# Altium project FlatLamp.PrjPcb
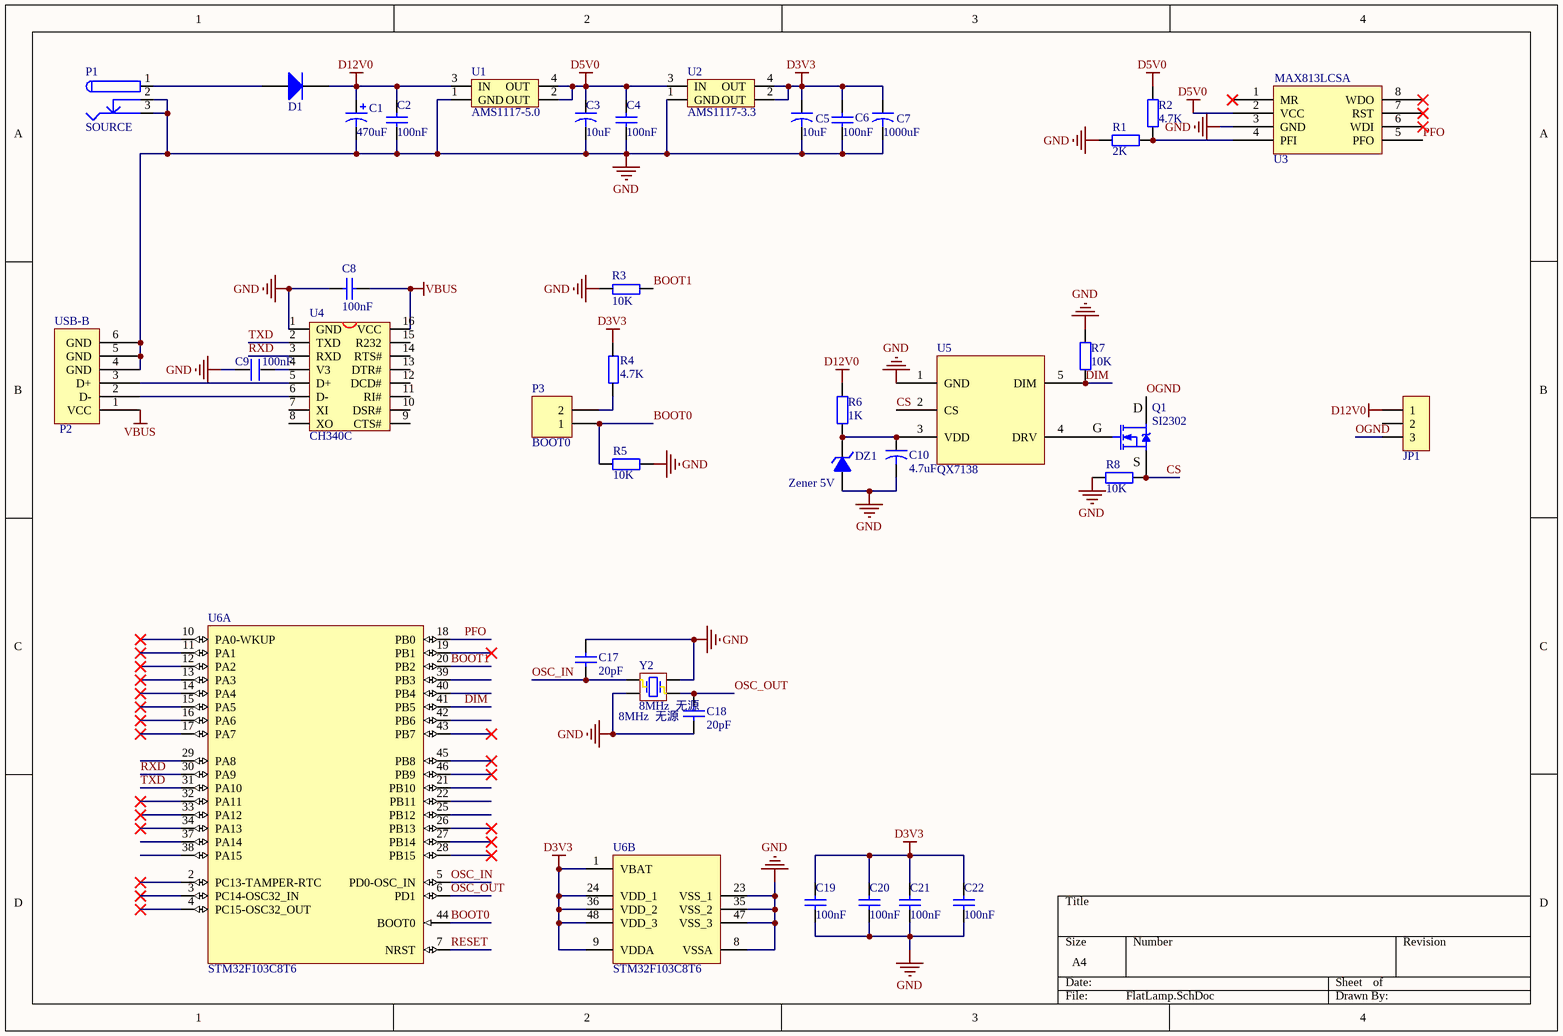
[diagram p0: FlatLamp.SchDoc]
1 sheet, 38 parts. Net scope: global (net labels, ports and power ports of the same name join across sheets).
Board file: FlatLamp.PcbDoc

## Sheet FlatLamp.SchDoc: YNAO Focuser
size A4; DrawnBy: ShouSheng He; Revision: v1.0

### Parts
C1  470uF  [16V/470U(CD10X10D5)]
C2  100nF  [0603C]
C3  10uF  [3216]
C4  100nF  [0603C]
C5  10uF  [3216]
C6  100nF  [0603C]
C7  1000uF  [16V/470U(CD10X10D5)]
C8  100nF  [0603C]
C9  100nF  [0603C]
C10  4.7uF  [3216]
C17  20pF  [0603C]
C18  20pF  [0603C]
C19  100nF  [0603C]
C20  100nF  [0603C]
C21  100nF  [0603C]
C22  100nF  [0603C]
D1  M7  [DO-214AC]  (value not drawn)
DZ1  Zener 5V  [SOD-323]
JP1  HDR-1X3  [HDR2.54-LI-3P]  (value not drawn)
P1  SOURCE  [DC_5.5MM]
P2  USB-B  [USB-B]
P3  BOOT0  [HDR1X2]
Q1  SI2302  [SOT23-3L]
R1  2K  [0603R]
R2  4.7K  [0603R]
R3  10K  [0603R]
R4  4.7K  [0603R]
R5  10K  [0603R]
R6  1K  [0603R]
R7  10K  [0603R]
R8  10K  [1206]
U1  AMS1117-5.0  [SOT223]
U2  AMS1117-3.3  [SOT223]
U3  MAX813LCSA  [SOP-8]
U4  CH340C  [SO-16]
U5  QX7138  [SOT23-5M]
U6  STM32F103C8T6  [LQFP48_N]  (parts A,B of 2)
Y2  8MHz  无源  [X3225]

### Nets
D3V3: C5.1 C6.2 C7.1 C19.2 C20.2 C21.2 C22.2 R4.2 U2.2(OUT) U2.4(OUT) U6.1(VBAT) U6.9(VDDA) U6.24(VDD_1) U6.36(VDD_2) U6.48(VDD_3)
D5V0: C3.1 C4.2 R2.2 U1.2(OUT) U1.4(OUT) U2.3(IN) U3.2(VCC)
D12V0: C1.1 C2.2 D1.2(K) JP1.1 R6.1 U1.3(IN)
GND: C1.2 C2.1 C3.2 C4.1 C5.2 C6.1 C7.2 C8.1 C9.1 C10.2 C17.2 C18.2 C19.1 C20.1 C21.1 C22.1 DZ1.1(A) P1.2 P1.3 P2.4(GND) P2.5(GND) P2.6(GND) R1.2 R3.1 R5.2 R7.1 R8.2 U1.1(GND) U2.1(GND) U3.3(GND) U4.1(GND) U5.1(GND) U6.8(VSSA) U6.23(VSS_1) U6.35(VSS_2) U6.47(VSS_3) Y2.2(NA) Y2.4(NA)
VBUS: C8.2 P2.1(VCC) U4.16(VCC)
BOOT0: P3.1 R5.1 U6.44(BOOT0)
BOOT1: R3.2 U6.20(PB2)
CS: Q1.2(S) R8.1 U5.2(CS)
DIM: R7.2 U5.5(DIM) U6.41(PB5)
OGND: JP1.3 Q1.3(D)
OSC_IN: C17.1 U6.5(PD0-OSC_IN) Y2.1(OSC1)
OSC_OUT: C18.1 U6.6(PD1) Y2.3(OSC2)
PFO: U3.5(PFO) U6.18(PB0)
RESET: U6.7(NRST)
RXD: U4.3(RXD) U6.30(PA9)
TXD: U4.2(TXD) U6.31(PA10)
NetC9_2: C9.2 U4.4(V3)
NetC10_1: C10.1 DZ1.2(K) R6.2 U5.3(VDD)
NetD1_1: D1.1(A) P1.1
NetP2_2: P2.2(D-) U4.6(D-)
NetP2_3: P2.3(D+) U4.5(D+)
NetP3_2: P3.2 R4.1
NetQ1_1: Q1.1(G) U5.4(DRV)
NetR1_1: R1.1 R2.1 U3.4(PFI)

Not connected (* = marked no-connect by the designer): JP1 2; U3 1(MR)* 6(WDI)* 7(RST)* 8(WDO)*; U4 7(XI) 8(XO) 9(CTS#) 10(DSR#) 11(RI#) 12(DCD#) 13(DTR#) 14(RTS#) 15(R232); U6 2(PC13-TAMPER-RTC)* 3(PC14-OSC32_IN)* 4(PC15-OSC32_OUT)* 10(PA0-WKUP)* 11(PA1)* 12(PA2)* 13(PA3)* 14(PA4)* 15(PA5)* 16(PA6)* 17(PA7)* 19(PB1)* 21(PB10) 22(PB11) 25(PB12) 26(PB13)* 27(PB14)* 28(PB15)* 29(PA8) 32(PA11)* 33(PA12)* 34(PA13)* 37(PA14) 38(PA15) 39(PB3) 40(PB4) 42(PB6) 43(PB7)* 45(PB8)* 46(PB9)*

### Library data of the parts
C1 = C470UF016S: 470UF      16V      CD10X10D5
C2 C4 C6 C8 C17-C22 = Cap: Capacitor; Published: 8-Jun-2000; LatestRevisionDate: 17-Jul-2002; LatestRevisionNote: Re-released for DXP Platform.; PackageReference: RAD-0.3; Publisher: Altium Limited
  C2 C4 C6 C8 C19-C22: Value: 100nF
  C17 C18: Value: 20pF
C3 C5 C7 C10 = CAP2
  C3 C5: vaule: 10uF
  C7: vaule: 1000uF
  C10: vaule: 4.7uF
C9 = C
D1 = Diode: High Conductance Fast Diode; pin to pad: 1>2 2>1; Published: 8-Jun-2000; LatestRevisionDate: 17-Jul-2002; LatestRevisionNote: Re-released for DXP Platform.; DatasheetDocument: 1997; PackageReference: DO-35; Publisher: Altium Limited; Code_JEDEC: DO-204-AH; ComponentLink1Description: Manufacturer Link; ComponentLink1URL: http://www.fairchildsemi.com/; ComponentLink2Description: Datasheet; ComponentLink2URL: http://www.fairchildsemi.com/ds/1N%2F1N4448.pdf
DZ1 = 1N4106: 12V/0.5W稳压管; 版权归属: 源创客; BOM名称: 12V/0.5W稳压管; 学习资源: www.ooocke.com
JP1 = Header 3: 3P接插件; 版权归属: 源创客; BOM名称: 3P接插件; 学习资源: www.ooocke.com
P3 = MHDR1X2: Header, 2-Pin; LatestRevisionDate: 17-Jul-2002; LatestRevisionNote: Re-released for DXP Platform.; Publisher: Altium Limited
Q1 = SI2302: N沟道场效应管; 版权归属: 源创客; BOM名称: N沟道场效应管; 学习资源: www.ooocke.com
R1 R2 R5 R7 R8 = RES: Resistor; Value: 1K; Published: 8-Jun-2000; Revision: July-2002: Re-released for DXP Platform.; Publisher: Altium Limited
R3 R4 = R
R6 = RES: Resistor; Published: 8-Jun-2000; Revision: July-2002: Re-released for DXP Platform.; Publisher: Altium Limited; Value: 1K
U1 U2 = AMS1117
U3 = MAX813L
U4 = CH340G: USB2UART
U6 = STM32F103C8T6: STM32 ARM-based 32-bit MCU Performance Line with 64 kB Flash, 20 kB Internal RAM, -40 to +85癈 Temperature, 48-Pin LQFP, Tray; DatasheetVersion: rev13.0, Apr-2011; PackageVersion: rev13, Apr-2011; PackageReference: LQFP48; PackageDescription: 48-Pin Low-Profile Quad Flat Pack, 7 x 7 mm Body, 0.5 mm Pitch (LQFP48); ComponentLink1Description: Manufacturer URL; ComponentLink1URL: http://www.st.com/; ComponentLink2Description: STM32F103 Datasheet; ComponentLink2URL: http://www.st.com/internet/com/TECHNICAL_RESOURCES/TECHNICAL_LITERATURE/DATASHEET/CD00161566.pdf; ComponentLink3Description: STM32 Family Web Page; ComponentLink3URL: www.st.com/stm32
Y2 = XTAL_1: Crystal Oscillator; Published: 8-Jun-2000; LatestRevisionDate: 17-Jul-2002; LatestRevisionNote: Re-released for DXP Platform.; PackageReference: R38; Publisher: Altium Limited; Value: 8MHz  无源
P1 = SOURCE: LatestRevisionDate: 17-Jul-2002; LatestRevisionNote: Re-released for DXP Platform.; Publisher: Altium Limited